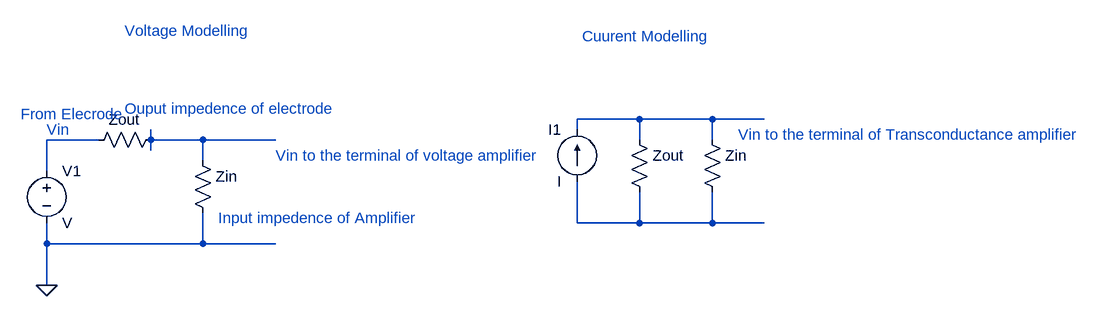
[diagram p0: schematic modeling.asc]
modeling.asc, the LTspice schematic file:
Version 4
SHEET 1 1584 680
WIRE 976 32 880 32
WIRE 1088 32 976 32
WIRE 1168 32 1088 32
WIRE 880 48 880 32
WIRE 144 64 64 64
WIRE 224 64 224 48
WIRE 304 64 224 64
WIRE 416 64 304 64
WIRE 976 64 976 32
WIRE 1088 64 1088 32
WIRE 224 80 224 64
WIRE 304 96 304 64
WIRE 64 112 64 64
WIRE 880 192 880 128
WIRE 976 192 976 144
WIRE 976 192 880 192
WIRE 1088 192 1088 144
WIRE 1088 192 976 192
WIRE 1168 192 1088 192
WIRE 64 224 64 192
WIRE 304 224 304 176
WIRE 304 224 64 224
WIRE 416 224 304 224
WIRE 64 288 64 224
FLAG 64 288 0
SYMBOL voltage 64 96 R0
SYMATTR InstName V1
SYMBOL res 240 48 R90
WINDOW 0 0 56 VBottom 2
WINDOW 3 32 56 VTop 2
SYMATTR InstName Zout
SYMATTR Value ""
SYMBOL res 288 80 R0
SYMATTR InstName Zin
SYMATTR Value ""
SYMBOL current 880 128 R180
WINDOW 0 24 80 Left 2
WINDOW 3 24 0 Left 2
SYMATTR InstName I1
SYMBOL res 960 48 R0
SYMATTR InstName Zout
SYMATTR Value ""
SYMBOL res 1072 48 R0
SYMATTR InstName Zin
SYMATTR Value ""
TEXT 64 48 Left 2 ;Vin
TEXT 24 24 Left 2 ;From Elecrode
TEXT 328 184 Left 2 ;Input impedence of Amplifier
TEXT 184 16 Left 2 ;Ouput impedence of electrode
TEXT 416 88 Left 2 ;Vin to the terminal of voltage amplifier
TEXT 184 -104 Left 2 ;Voltage Modelling
TEXT 888 -96 Left 2 ;Cuurent Modelling
TEXT 1128 56 Left 2 ;Vin to the terminal of Transconductance amplifier

The netlist it stands for:
* modeling.asc
V1 N002 0 V
R§Zout N003 N002
R§Zin N003 0
I1 N004 N001 I
R§Zout N001 N004
R§Zin N001 N004
* Vin
* From Elecrode
* Input impedence of Amplifier
* Ouput impedence of electrode
* Vin to the terminal of voltage amplifier
* Voltage Modelling
* Cuurent Modelling
* Vin to the terminal of Transconductance amplifier
.backanno
.end